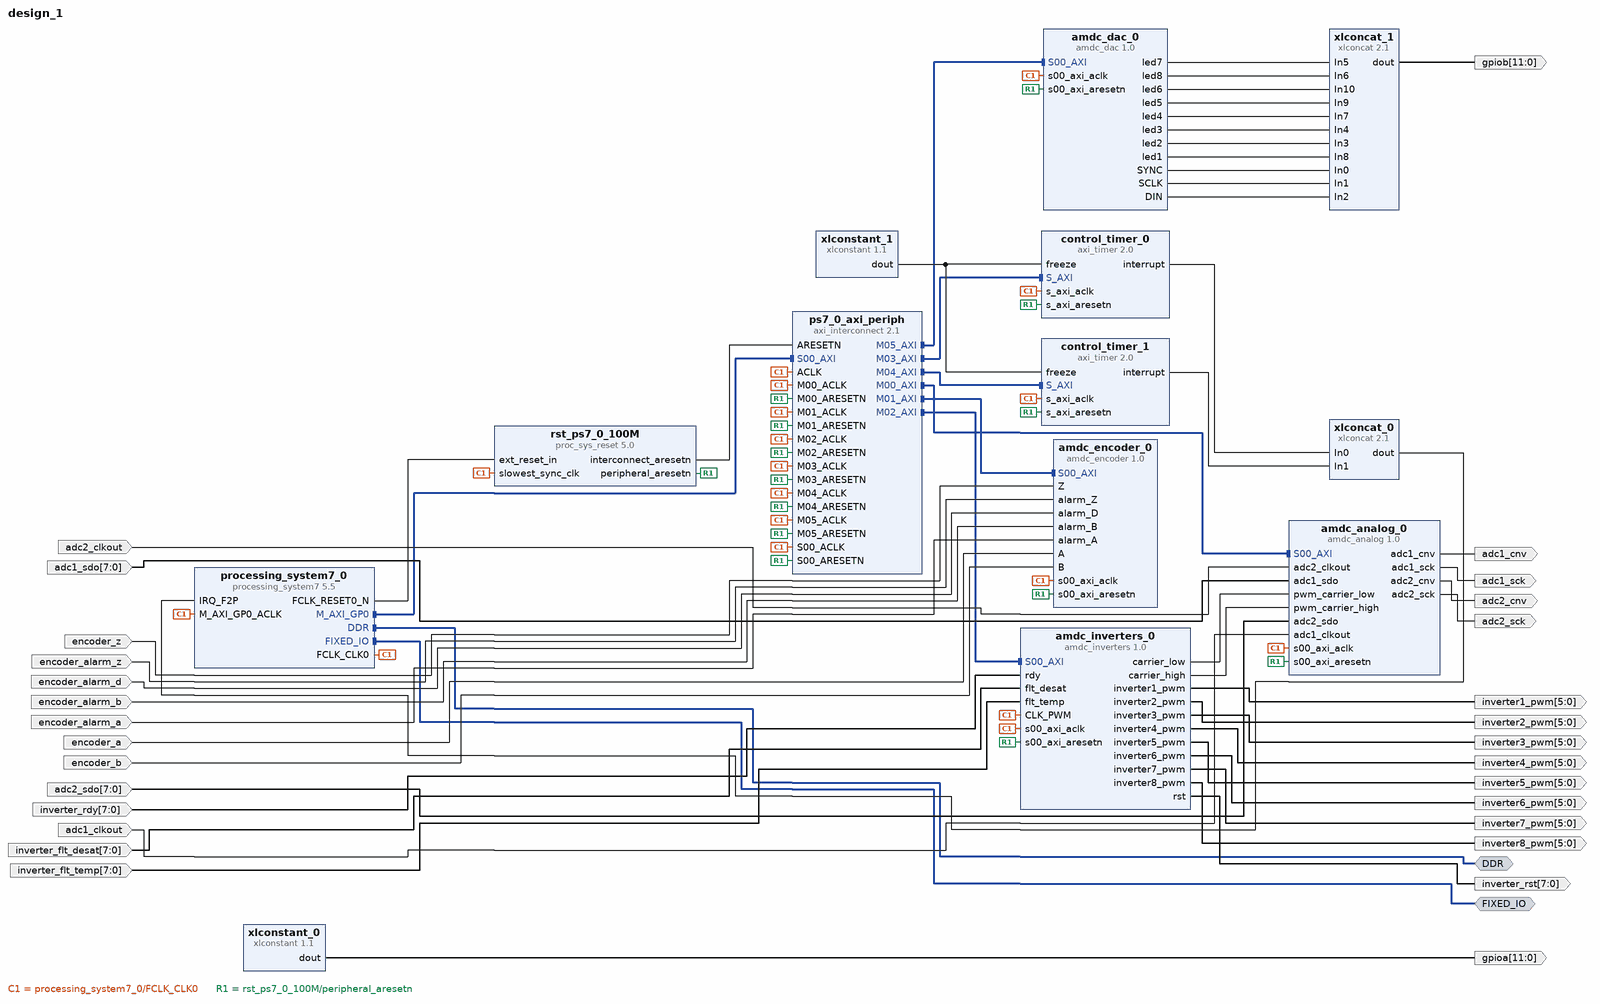
[diagram p0: block diagram of the top level]
# Vivado block design design_1, xc7z030sbg485-1, Vivado 2017.2
create_bd_design design_1

create_bd_intf_port -mode Master -vlnv xilinx.com:interface:ddrx_rtl:1.0 DDR
create_bd_intf_port -mode Master -vlnv xilinx.com:display_processing_system7:fixedio_rtl:1.0 FIXED_IO
create_bd_port -dir I -type data adc2_clkout
create_bd_port -dir I -from 7 -to 0 -type data adc1_sdo
create_bd_port -dir I -from 7 -to 0 -type data adc2_sdo
create_bd_port -dir O -from 11 -to 0 -type data gpioa
create_bd_port -dir I -type data adc1_clkout
create_bd_port -dir O -type data adc1_sck
create_bd_port -dir O -type data adc1_cnv
create_bd_port -dir O -type data adc2_sck
create_bd_port -dir O -type data adc2_cnv
create_bd_port -dir I -type data encoder_z
create_bd_port -dir I -type data encoder_alarm_z
create_bd_port -dir I -type data encoder_alarm_d
create_bd_port -dir I -type data encoder_alarm_b
create_bd_port -dir I -type data encoder_alarm_a
create_bd_port -dir I -type data encoder_a
create_bd_port -dir I -type data encoder_b
create_bd_port -dir I -from 7 -to 0 -type data inverter_rdy
create_bd_port -dir I -from 7 -to 0 -type data inverter_flt_desat
create_bd_port -dir I -from 7 -to 0 -type data inverter_flt_temp
create_bd_port -dir O -from 5 -to 0 -type data inverter8_pwm
create_bd_port -dir O -from 5 -to 0 -type data inverter7_pwm
create_bd_port -dir O -from 5 -to 0 -type data inverter6_pwm
create_bd_port -dir O -from 5 -to 0 -type data inverter5_pwm
create_bd_port -dir O -from 5 -to 0 -type data inverter4_pwm
create_bd_port -dir O -from 5 -to 0 -type data inverter3_pwm
create_bd_port -dir O -from 5 -to 0 -type data inverter2_pwm
create_bd_port -dir O -from 5 -to 0 -type data inverter1_pwm
create_bd_port -dir O -from 7 -to 0 -type rst inverter_rst
create_bd_port -dir O -from 11 -to 0 -type data gpiob

create_bd_cell -type ip -vlnv xilinx.com:ip:processing_system7:5.5 processing_system7_0
set_property -dict [list \
  CONFIG.PCW_FCLK_CLK1_BUF TRUE \
  CONFIG.PCW_APU_PERIPHERAL_FREQMHZ 667 \
  CONFIG.PCW_UART_PERIPHERAL_FREQMHZ 50 \
  CONFIG.PCW_FPGA0_PERIPHERAL_FREQMHZ 200 \
  CONFIG.PCW_FPGA1_PERIPHERAL_FREQMHZ 50 \
  CONFIG.PCW_FPGA2_PERIPHERAL_FREQMHZ 100 \
  CONFIG.PCW_USE_FABRIC_INTERRUPT 1 \
  CONFIG.PCW_EN_CLK1_PORT 1 \
  CONFIG.PCW_EN_CLK2_PORT 1 \
  CONFIG.PCW_P2F_UART0_INTR 1 \
  CONFIG.PCW_IRQ_F2P_INTR 1 \
  CONFIG.PCW_PRESET_BANK1_VOLTAGE {LVCMOS 1.8V} \
  CONFIG.PCW_UIPARAM_DDR_MEMORY_TYPE {DDR 3 (Low Voltage)} \
  CONFIG.PCW_UIPARAM_DDR_PARTNO {MT41K256M16 RE-125} \
  CONFIG.PCW_QSPI_PERIPHERAL_ENABLE 1 \
  CONFIG.PCW_QSPI_QSPI_IO {MIO 1 .. 6} \
  CONFIG.PCW_QSPI_GRP_SINGLE_SS_ENABLE 1 \
  CONFIG.PCW_ENET0_PERIPHERAL_ENABLE 1 \
  CONFIG.PCW_ENET0_ENET0_IO {MIO 16 .. 27} \
  CONFIG.PCW_SD0_PERIPHERAL_ENABLE 0 \
  CONFIG.PCW_SD1_PERIPHERAL_ENABLE 1 \
  CONFIG.PCW_SD1_SD1_IO {MIO 10 .. 15} \
  CONFIG.PCW_SD1_GRP_CD_ENABLE 1 \
  CONFIG.PCW_UART0_PERIPHERAL_ENABLE 1 \
  CONFIG.PCW_UART0_UART0_IO {MIO 50 .. 51} \
  CONFIG.PCW_UART1_PERIPHERAL_ENABLE 0 \
  CONFIG.PCW_USB0_PERIPHERAL_ENABLE 0 \
  CONFIG.PCW_I2C_RESET_ENABLE 0 \
  CONFIG.PCW_GPIO_PERIPHERAL_ENABLE 1 \
  CONFIG.PCW_GPIO_MIO_GPIO_ENABLE 1 \
] [get_bd_cells processing_system7_0]
# 159 more settings of processing_system7_0 are not shown: defaults, MIO pin electricals, DDR timing, and values the tool derives
create_bd_cell -type ip -vlnv xilinx.com:ip:axi_interconnect:2.1 ps7_0_axi_periph
set_property -dict {CONFIG.NUM_MI 6} [get_bd_cells ps7_0_axi_periph]
create_bd_cell -type ip -vlnv xilinx.com:ip:proc_sys_reset:5.0 rst_ps7_0_100M
create_bd_cell -type ip -vlnv xilinx.com:ip:xlconstant:1.1 xlconstant_0
set_property -dict {CONFIG.CONST_WIDTH 12 CONFIG.CONST_VAL 0b010101010101} [get_bd_cells xlconstant_0]
create_bd_cell -type ip -vlnv xilinx.com:ip:axi_timer:2.0 control_timer_0
create_bd_cell -type ip -vlnv xilinx.com:ip:axi_timer:2.0 control_timer_1
create_bd_cell -type ip -vlnv xilinx.com:ip:xlconcat:2.1 xlconcat_0
set_property -dict {CONFIG.NUM_PORTS 2} [get_bd_cells xlconcat_0]
create_bd_cell -type ip -vlnv xilinx.com:ip:xlconstant:1.1 xlconstant_1
set_property -dict {CONFIG.CONST_VAL 0} [get_bd_cells xlconstant_1]
create_bd_cell -type ip -vlnv wisc.edu:user:amdc_encoder:1.0 amdc_encoder_0
create_bd_cell -type ip -vlnv xilinx.com:ip:xlconcat:2.1 xlconcat_1
set_property -dict {CONFIG.NUM_PORTS 12} [get_bd_cells xlconcat_1]
create_bd_cell -type ip -vlnv wisc.edu:user:amdc_dac:1.0 amdc_dac_0
create_bd_cell -type ip -vlnv wisc.edu:user:amdc_analog:1.0 amdc_analog_0
create_bd_cell -type ip -vlnv wisc.edu:user:amdc_inverters:1.0 amdc_inverters_0

# ---- connections ----

connect_bd_intf_net [get_bd_intf_pins processing_system7_0/M_AXI_GP0] [get_bd_intf_pins ps7_0_axi_periph/S00_AXI]
connect_bd_intf_net [get_bd_intf_pins ps7_0_axi_periph/M00_AXI] [get_bd_intf_pins amdc_analog_0/S00_AXI]
connect_bd_intf_net [get_bd_intf_pins ps7_0_axi_periph/M01_AXI] [get_bd_intf_pins amdc_encoder_0/S00_AXI]
connect_bd_intf_net [get_bd_intf_pins ps7_0_axi_periph/M02_AXI] [get_bd_intf_pins amdc_inverters_0/S00_AXI]
connect_bd_intf_net [get_bd_intf_pins ps7_0_axi_periph/M03_AXI] [get_bd_intf_pins control_timer_0/S_AXI]
connect_bd_intf_net [get_bd_intf_pins ps7_0_axi_periph/M04_AXI] [get_bd_intf_pins control_timer_1/S_AXI]
connect_bd_intf_net [get_bd_intf_pins ps7_0_axi_periph/M05_AXI] [get_bd_intf_pins amdc_dac_0/S00_AXI]
connect_bd_intf_net [get_bd_intf_ports DDR] [get_bd_intf_pins processing_system7_0/DDR]
connect_bd_intf_net [get_bd_intf_ports FIXED_IO] [get_bd_intf_pins processing_system7_0/FIXED_IO]
connect_bd_net [get_bd_pins processing_system7_0/FCLK_CLK0] \
  [get_bd_pins processing_system7_0/M_AXI_GP0_ACLK] [get_bd_pins rst_ps7_0_100M/slowest_sync_clk] \
  [get_bd_pins control_timer_0/s_axi_aclk] [get_bd_pins control_timer_1/s_axi_aclk] [get_bd_pins amdc_encoder_0/s00_axi_aclk] \
  [get_bd_pins amdc_dac_0/s00_axi_aclk] [get_bd_pins amdc_analog_0/s00_axi_aclk] [get_bd_pins ps7_0_axi_periph/S00_ACLK] \
  [get_bd_pins ps7_0_axi_periph/M00_ACLK] [get_bd_pins ps7_0_axi_periph/ACLK] [get_bd_pins ps7_0_axi_periph/M01_ACLK] \
  [get_bd_pins ps7_0_axi_periph/M02_ACLK] [get_bd_pins ps7_0_axi_periph/M03_ACLK] [get_bd_pins ps7_0_axi_periph/M04_ACLK] \
  [get_bd_pins ps7_0_axi_periph/M05_ACLK] [get_bd_pins amdc_inverters_0/CLK_PWM] [get_bd_pins amdc_inverters_0/s00_axi_aclk]
connect_bd_net [get_bd_pins processing_system7_0/FCLK_RESET0_N] [get_bd_pins rst_ps7_0_100M/ext_reset_in]
connect_bd_net [get_bd_pins rst_ps7_0_100M/peripheral_aresetn] \
  [get_bd_pins control_timer_0/s_axi_aresetn] [get_bd_pins control_timer_1/s_axi_aresetn] \
  [get_bd_pins amdc_encoder_0/s00_axi_aresetn] [get_bd_pins amdc_dac_0/s00_axi_aresetn] \
  [get_bd_pins amdc_analog_0/s00_axi_aresetn] [get_bd_pins ps7_0_axi_periph/S00_ARESETN] \
  [get_bd_pins ps7_0_axi_periph/M00_ARESETN] [get_bd_pins ps7_0_axi_periph/M01_ARESETN] \
  [get_bd_pins ps7_0_axi_periph/M02_ARESETN] [get_bd_pins ps7_0_axi_periph/M03_ARESETN] \
  [get_bd_pins ps7_0_axi_periph/M04_ARESETN] [get_bd_pins ps7_0_axi_periph/M05_ARESETN] \
  [get_bd_pins amdc_inverters_0/s00_axi_aresetn]
connect_bd_net [get_bd_pins rst_ps7_0_100M/interconnect_aresetn] [get_bd_pins ps7_0_axi_periph/ARESETN]
connect_bd_net [get_bd_ports adc2_clkout] [get_bd_pins amdc_analog_0/adc2_clkout]
connect_bd_net [get_bd_ports adc1_sdo] [get_bd_pins amdc_analog_0/adc1_sdo]
connect_bd_net [get_bd_ports adc2_sdo] [get_bd_pins amdc_analog_0/adc2_sdo]
connect_bd_net [get_bd_pins xlconstant_0/dout] [get_bd_ports gpioa]
connect_bd_net [get_bd_ports adc1_clkout] [get_bd_pins amdc_analog_0/adc1_clkout]
connect_bd_net [get_bd_pins amdc_analog_0/adc1_sck] [get_bd_ports adc1_sck]
connect_bd_net [get_bd_pins amdc_analog_0/adc1_cnv] [get_bd_ports adc1_cnv]
connect_bd_net [get_bd_pins amdc_analog_0/adc2_sck] [get_bd_ports adc2_sck]
connect_bd_net [get_bd_pins amdc_analog_0/adc2_cnv] [get_bd_ports adc2_cnv]
connect_bd_net [get_bd_ports encoder_z] [get_bd_pins amdc_encoder_0/Z]
connect_bd_net [get_bd_ports encoder_alarm_z] [get_bd_pins amdc_encoder_0/alarm_Z]
connect_bd_net [get_bd_ports encoder_alarm_d] [get_bd_pins amdc_encoder_0/alarm_D]
connect_bd_net [get_bd_ports encoder_alarm_b] [get_bd_pins amdc_encoder_0/alarm_B]
connect_bd_net [get_bd_ports encoder_alarm_a] [get_bd_pins amdc_encoder_0/alarm_A]
connect_bd_net [get_bd_ports encoder_a] [get_bd_pins amdc_encoder_0/A]
connect_bd_net [get_bd_ports encoder_b] [get_bd_pins amdc_encoder_0/B]
connect_bd_net [get_bd_ports inverter_rdy] [get_bd_pins amdc_inverters_0/rdy]
connect_bd_net [get_bd_ports inverter_flt_desat] [get_bd_pins amdc_inverters_0/flt_desat]
connect_bd_net [get_bd_ports inverter_flt_temp] [get_bd_pins amdc_inverters_0/flt_temp]
connect_bd_net [get_bd_pins amdc_inverters_0/inverter8_pwm] [get_bd_ports inverter8_pwm]
connect_bd_net [get_bd_pins amdc_inverters_0/inverter7_pwm] [get_bd_ports inverter7_pwm]
connect_bd_net [get_bd_pins amdc_inverters_0/inverter6_pwm] [get_bd_ports inverter6_pwm]
connect_bd_net [get_bd_pins amdc_inverters_0/inverter5_pwm] [get_bd_ports inverter5_pwm]
connect_bd_net [get_bd_pins amdc_inverters_0/inverter4_pwm] [get_bd_ports inverter4_pwm]
connect_bd_net [get_bd_pins amdc_inverters_0/inverter3_pwm] [get_bd_ports inverter3_pwm]
connect_bd_net [get_bd_pins amdc_inverters_0/inverter2_pwm] [get_bd_ports inverter2_pwm]
connect_bd_net [get_bd_pins amdc_inverters_0/inverter1_pwm] [get_bd_ports inverter1_pwm]
connect_bd_net [get_bd_pins amdc_inverters_0/rst] [get_bd_ports inverter_rst]
connect_bd_net [get_bd_pins control_timer_0/interrupt] [get_bd_pins xlconcat_0/In0]
connect_bd_net [get_bd_pins xlconcat_0/dout] [get_bd_pins processing_system7_0/IRQ_F2P]
connect_bd_net [get_bd_pins control_timer_1/interrupt] [get_bd_pins xlconcat_0/In1]
connect_bd_net [get_bd_pins xlconstant_1/dout] [get_bd_pins control_timer_0/freeze] [get_bd_pins control_timer_1/freeze]
connect_bd_net [get_bd_pins xlconcat_1/dout] [get_bd_ports gpiob]
connect_bd_net [get_bd_pins amdc_dac_0/led7] [get_bd_pins xlconcat_1/In5]
connect_bd_net [get_bd_pins amdc_dac_0/led8] [get_bd_pins xlconcat_1/In6]
connect_bd_net [get_bd_pins amdc_dac_0/led6] [get_bd_pins xlconcat_1/In10]
connect_bd_net [get_bd_pins amdc_dac_0/led5] [get_bd_pins xlconcat_1/In9]
connect_bd_net [get_bd_pins amdc_dac_0/led4] [get_bd_pins xlconcat_1/In7]
connect_bd_net [get_bd_pins amdc_dac_0/led3] [get_bd_pins xlconcat_1/In4]
connect_bd_net [get_bd_pins amdc_dac_0/led2] [get_bd_pins xlconcat_1/In3]
connect_bd_net [get_bd_pins amdc_dac_0/led1] [get_bd_pins xlconcat_1/In8]
connect_bd_net [get_bd_pins amdc_dac_0/SYNC] [get_bd_pins xlconcat_1/In0]
connect_bd_net [get_bd_pins amdc_dac_0/SCLK] [get_bd_pins xlconcat_1/In1]
connect_bd_net [get_bd_pins amdc_dac_0/DIN] [get_bd_pins xlconcat_1/In2]
connect_bd_net [get_bd_pins amdc_inverters_0/carrier_low] [get_bd_pins amdc_analog_0/pwm_carrier_low]
connect_bd_net [get_bd_pins amdc_inverters_0/carrier_high] [get_bd_pins amdc_analog_0/pwm_carrier_high]

# ---- address map ----
assign_bd_address -offset 0x42800000 -range 64K -target_address_space [get_bd_addr_spaces processing_system7_0/Data] [get_bd_addr_segs control_timer_0/S_AXI/Reg]
assign_bd_address -offset 0x42810000 -range 64K -target_address_space [get_bd_addr_spaces processing_system7_0/Data] [get_bd_addr_segs control_timer_1/S_AXI/Reg]
assign_bd_address -offset 0x43C00000 -range 64K -target_address_space [get_bd_addr_spaces processing_system7_0/Data] [get_bd_addr_segs amdc_analog_0/S00_AXI/S00_AXI_reg]
assign_bd_address -offset 0x43C10000 -range 64K -target_address_space [get_bd_addr_spaces processing_system7_0/Data] [get_bd_addr_segs amdc_encoder_0/S00_AXI/S00_AXI_reg]
assign_bd_address -offset 0x43C20000 -range 64K -target_address_space [get_bd_addr_spaces processing_system7_0/Data] [get_bd_addr_segs amdc_inverters_0/S00_AXI/S00_AXI_reg]
assign_bd_address -offset 0x43C30000 -range 64K -target_address_space [get_bd_addr_spaces processing_system7_0/Data] [get_bd_addr_segs amdc_dac_0/S00_AXI/S00_AXI_reg]

validate_bd_design
save_bd_design
